# EAGLE design Sandy R2 (EAGLE 7.2.0)
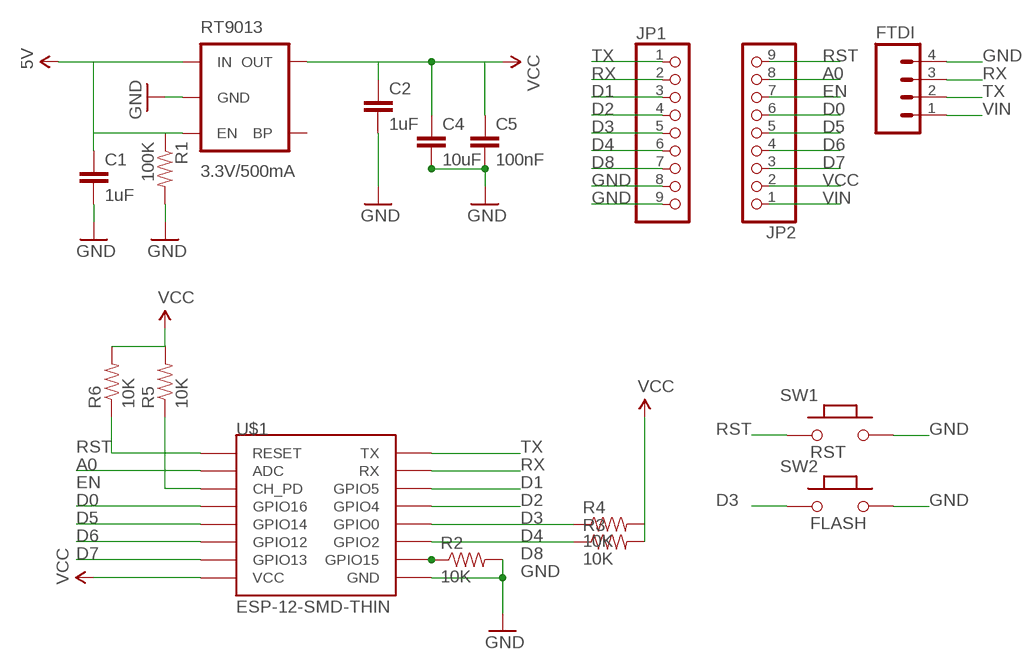
[diagram p0: schematic, sheet 1]

## Parts
C1  1uF  CAP0805  [0805]
C2  1uF  22UF-6.3V-20%(0805)  [0805]
C4  10uF  CAP0805  [0805]
C5  100nF  22UF-6.3V-20%(0805)  [0805]
FTDI  M04PTH  [1X04]
JP1  PINHD-1X9  [1X09-BIG]
JP2  PINHD-1X9  [1X09-BIG]
R1  100K  RESISTOR0805-RES  [0805]
R2  10K  RESISTOR0805-RES  [0805]
R3  10K  RESISTOR0805-RES  [0805]
R4  10K  RESISTOR0805-RES  [0805]
R5  10K  RESISTOR0805-RES  [0805]
R6  10K  RESISTOR0805-RES  [0805]
RT9013  3.3V/500mA  V_REG_MIC52053.3V  [SOT23-5]
SW1  RST  PB157  [157SW]
SW2  FLASH  PB157  [157SW]
U$1  ESP-12-SMD-THIN  [ESP-12-SMD-THIN]

## Nets
A0: JP2.8 U$1.ADC
D0: JP2.6 U$1.GPIO16
D1: JP1.3 U$1.GPIO5
D2: JP1.4 U$1.GPIO4
D3: JP1.5 R4.1 SW2.1 U$1.GPIO0
D4: JP1.6 R3.1 U$1.GPIO2
D5: JP2.5 U$1.GPIO14
D6: JP2.4 U$1.GPIO12
D7: JP2.3 U$1.GPIO13
D8: JP1.7 R2.1 U$1.GPIO15
EN: JP2.7 R5.1 U$1.CH_PD
GND: C1.2 C2.2 C4.2 C5.2 FTDI.4 JP1.8 JP1.9 R1.2 R2.2 RT9013.2(GND) SW1.2 SW2.2 U$1.GND
RST: JP2.9 R6.1 SW1.1 U$1.RESET
RX: FTDI.3 JP1.2 U$1.RXD0(RX)
TX: FTDI.2 JP1.1 U$1.TXD0(TX)
VCC: C2.1 C4.1 C5.1 JP2.2 R3.2 R4.2 R5.2 R6.2 RT9013.5(OUT) U$1.VCC
VIN: C1.1 FTDI.1 JP2.1 R1.1 RT9013.1(IN) RT9013.3(EN) ; supply symbol labelled 5V
Unconnected: RT9013.4(BP)

## Library data of the parts
C1 C4 = SparkFun-Passives:CAP: Capacitor Standard 0603 ceramic capacitor, and 0.1" leaded capacitor.
C2 C5 = SparkFun-Capacitors:22UF-6.3V-20%(0805): CAP-08402 Ceramic; PROD_ID: CAP-08402; VALUE: 22uF
FTDI = SparkFun-Connectors:M04: Header 4 Standard 4-pin 0.1" header. Use with straight break away headers (SKU : PRT-00116), right angle break away headers (PRT-00553), swiss pins (PRT-00743), machine pins (PRT-00117), and female headers (PRT-00115). Molex polarized connector foot print use with SKU : PRT-08231 with associated crimp pins and housings. 1MM SMD Version SKU: PRT-10208
JP1 JP2 = adafruit:PINHD-1X9: Pin header 1x10 0.1" spacing With round pins
R1-R6 = SparkFun-Passives:RESISTOR: Resistor Basic schematic elements and footprints for 0603, 1206, and PTH resistors.
RT9013 = SparkFun-PowerIC:V_REG_MIC5205: V_REG MIC5205 Standard 3.3V, 5V, and Adjustable 150mA LDO voltage regulator in SOT-23 layout. Micrel part MIC5205. BP (by-pass) pin is used to lower output noise with 470pF cap, may be left open. On the adjustable version BP is used to set output.; PROD_ID: VREG-00822; VALUE: 3.3V/150mA
SW1 SW2 = MySMD:PB157
U$1 = My Eagle Lib:ESP-12-SMD-THIN

## Board
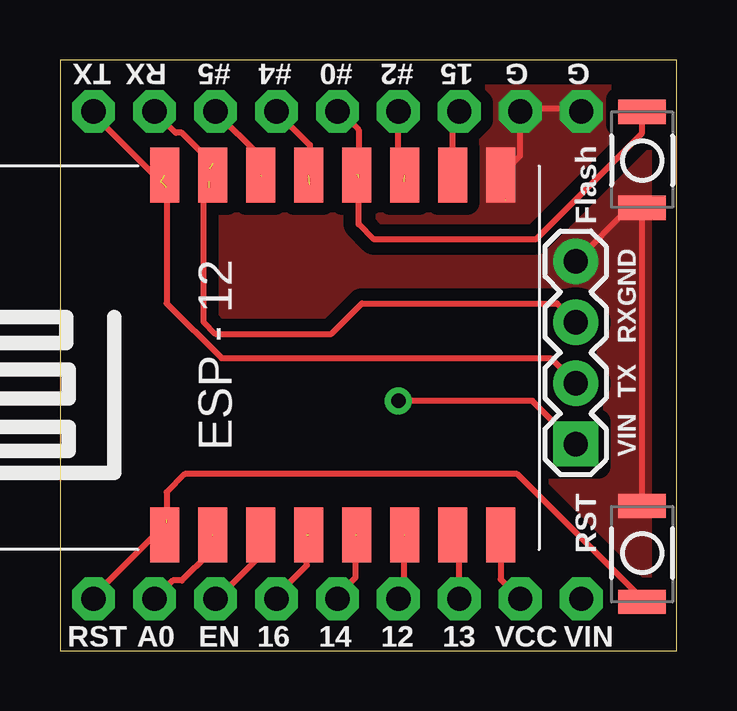
[diagram p1: board, top side]
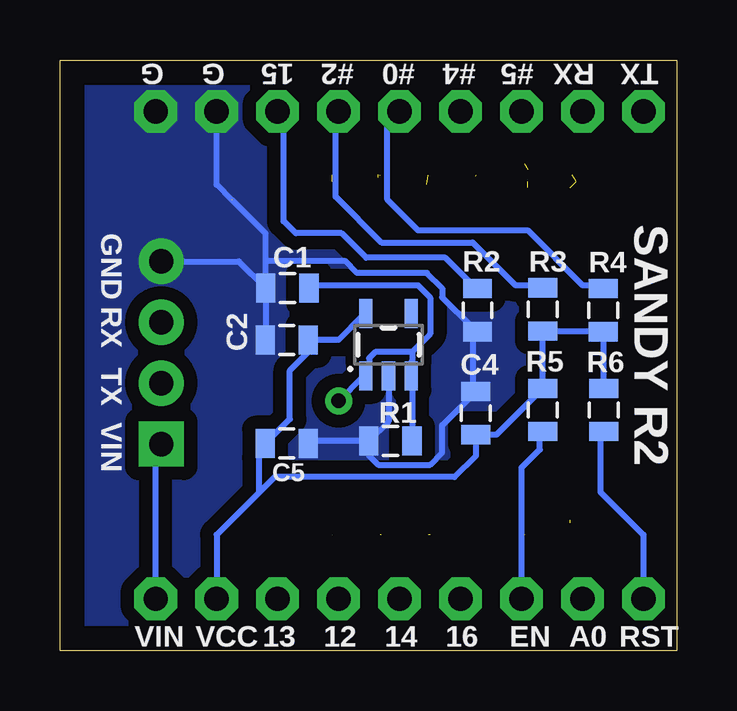
[diagram p2: board, bottom side, seen from below]

Size 25.71 x 24.63 mm. Coordinates in mm from the lower left corner, seen from the top.
Outline: 0,24.63 0,0 25.71,0 25.71,24.63 0,24.63
Copper layers (1*16): Top 0.035mm / dielectric 1.5mm / Bottom 0.035mm
Design rules "default *": minimum track width 10mil, minimum drill 24mil, track to track 10mil, track to pad 10mil, pad to pad 10mil, via to via 10mil, smd to smd 10mil, copper to edge 40mil, drill to drill 10mil, minimum pad ring 13mil, minimum via ring 10mil, stop-mask expansion 4mil, vias tented up to drill 0mil, thermal gap 10mil

### Footprints (pad centres in the part's own frame; a part is rotated, then mirrored left to right if it is on the bottom)
0805 = smd 0.8 x 1.2: 1 -0.9,0; 2 0.9,0
1X04 = drill 1.016 pad 1.88 square: 1 0,0 | drill 1.016 pad 1.88: 2 2.54,0; 3 5.08,0; 4 7.62,0
1X09-BIG = drill 1.016 pad 1.778 octagon: 1 -10.16,0; 2 -7.62,0; 3 -5.08,0; 4 -2.54,0; 5 0,0; 6 2.54,0; 7 5.08,0; 8 7.62,0; 9 10.16,0
SOT23-5 = smd 0.55 x 1.2: 1 -0.95,-1.3; 2 0,-1.3; 3 0.95,-1.3; 4 0.95,1.3; 5 -0.95,1.3
157SW = smd 1.016 x 1.981: 1 0,0; 2 4,0
ESP-12-SMD-THIN = smd 2.286 x 1.2: ADC -7.5,3.8; CH_PD -7.5,1.8; GND 7.5,-8.2; GPIO0 7.5,-2.2; GPIO2 7.5,-4.2; GPIO4 7.5,-0.2; GPIO5 7.5,1.8; GPIO12 -7.5,-4.2; GPIO13 -7.5,-6.2; GPIO14 -7.5,-2.2; GPIO15 7.5,-6.2; GPIO16 -7.5,-0.2; RESET -7.5,5.8; RXD0 7.5,3.8; TXD0 7.5,5.8; VCC -7.5,-8.2

### Placement (x,y rotation side)
C1  16.23,15.11 180 bottom
C2  16.26,12.95 180 bottom
C4  8.38,9.91 90 bottom
C5  16.26,8.64 0 bottom
FTDI  21.49,8.61 90 top
JP1  11.56,22.48 0 top
JP2  11.56,2.16 180 top
R1  11.94,8.74 180 bottom
R2  8.31,14.2 270 bottom
R3  5.59,14.22 270 bottom
R4  3.07,14.2 270 bottom
R5  5.59,10.03 90 bottom
R6  3.05,10.03 90 bottom
RT9013  12.01,12.75 0 bottom
SW1  24.26,2.03 90 top
SW2  24.26,22.47 270 top
U$1  10.16,12.32 90 top

### Tracks (layer width: path | path; a pad name or v marks a point on that pad's centre or on a via)
A0  (1 unrouted)
  Top 0.254: U$1.ADC 6.22,4.06 5.08,2.92 4.7,2.92 JP2.8 3.94,2.29
D0  (1 unrouted)
  Top 0.254: 10.29,4.83 10.29,3.56 9.02,2.29 JP2.6
D1  (1 unrouted)
  Top 0.254: JP1.3 8.38,20.57 8.38,19.78
D2  (1 unrouted)
  Top 0.254: JP1.4 10.41,21.08 10.41,19.43
D3  (2 unrouted)
  Top 0.254: JP1.5 11.68,22.48 12.45,21.72 12.45,19.84 | 12.45,19.72 12.45,17.78 13.08,17.15 19.82,17.15 24.26,21.58 SW2.1
  Bottom 0.254: R4.1 3.17,15.24 3.94,15.24 6.22,17.53 10.79,17.53 12.06,18.8 12.06,21.97 JP1.5
D4  (1 unrouted)
  Top 0.254: JP1.6 14.1,19.81 14.35,19.56
  Bottom 0.254: R3.1 5.72,15.24 6.73,15.24 8.51,17.02 12.32,17.02 14.22,18.92 14.22,22.35 JP1.6
D5  (1 unrouted)
  Top 0.254: 12.32,4.83 12.32,3.05 11.56,2.29 JP2.5
D6  (1 unrouted)
  Top 0.254: U$1.GPIO12 14.35,2.54 14.1,2.29 JP2.4
D7
  Top 0.254: JP2.3 16.64,4.54 U$1.GPIO13
D8
  Top 0.254: U$1.GPIO15 16.36,22.2 JP1.7
  Bottom 0.254: R2.1 8.37,15.1 9.65,16.38 12.95,16.38 13.97,17.4 15.88,17.4 16.38,17.91 16.38,22.23 JP1.7
EN
  Top 0.254: JP2.7 6.55,2.16 8.36,3.96 U$1.CH_PD
  Bottom 0.254: R5.1 5.72,8.89 5.72,8.38 6.48,7.62 JP2.7
GND  (1 unrouted)
  Top 0.254: JP1.9 21.72,22.61 19.18,22.61 JP1.8 19.18,20.64 U$1.GND | SW1.2 SW2.2 23.73,18.47 FTDI.4
  Bottom 0.254: 17.14,16.26 17.14,17.4 18.55,18.8 | 17.14,16.26 17.14,15.24 C1.2 | 17.14,16.26 13.84,16.26 13.34,15.75 10.41,15.75 9.78,15.11 9.78,14.73 8.51,13.46 R2.2 8.51,13.21 8.51,10.92 C4.2 8.51,10.67 9.78,9.4 9.78,8.26 10.29,7.75 12.45,7.75 12.83,8.13 12.83,8.73 R1.2 | R1.2 15.25,8.74 C5.2 | RT9013.2 12.01,9.56 R1.2 | C1.2 17.13,12.98 C2.2 | 18.55,18.79 19.18,19.42 JP1.8 | FTDI.4 18.25,16.23 C1.2
  pour Bottom (isolate 0.559, no thermals): -1.52,26.04 27.18,26.04 27.18,-1.02 -1.52,-1.02
  pour Top (isolate 0.508, no thermals): -1.52,26.04 27.18,26.04 27.18,-1.02 -1.52,-1.02
RST  (1 unrouted)
  Top 0.254: 4.44,5.33 4.13,5.02 | 4.13,5.02 1.4,2.29 JP2.9 | 4.44,5.46 4.44,6.6 5.21,7.37 19.05,7.37 24.26,2.16 SW1.1 | U$1.RESET 4.16,5.02 4.13,5.02
  Bottom 0.254: R6.1 3.17,8.89 3.17,6.6 1.4,4.83 JP2.9
RX  (2 unrouted)
  Top 0.254: 6.22,20.07 6.22,19.56 | 3.94,22.35 JP1.2 4.83,21.59 5.08,21.59 6.36,20.31 U$1.RXD0 | 6.22,19.3 5.97,19.05 5.97,13.72 6.48,13.21 11.3,13.21 12.57,14.48 20.7,14.48 FTDI.3
TX  (2 unrouted)
  Top 0.254: 4.19,19.56 1.4,22.35 JP1.1 | 4.44,19.3 4.44,14.48 6.73,12.19 20.45,12.19 FTDI.2
VCC
  Top 0.254: U$1.VCC 18.36,2.98 JP2.2
  Bottom 0.254: RT9013.5 13.08,13.97 14.1,12.95 C2.1 15.37,12.45 16.13,11.68 16.13,9.65 C5.1 17.4,8.64 17.4,6.6 | 17.4,6.6 19.18,4.83 JP2.2 | 17.4,6.6 16.76,7.24 9.27,7.24 8.38,8.13 C4.1 7.51,9.01 R5.2 R3.2 3.1,13.32 R4.2 3.07,10.96 R6.2
VIN  (via drill 0.61)
  Top 0.254: v14.1,10.41 19.68,10.41 FTDI.1
  Bottom 0.254: 11.05,12.45 12.57,12.45 12.83,12.19 12.83,11.68 RT9013.1 13.08,11.43 v14.1,10.41 | 11.05,12.45 10.29,13.21 10.29,14.73 10.79,15.24 15.11,15.24 C1.1 | 11.05,12.45 11.04,12.45 11.04,12.06 | 11.04,12.06 R1.1 | RT9013.3 11.06,12.04 11.04,12.06 | JP2.1 21.72,8.38 FTDI.1

### Text on the board
tNames: TX | RX | #5 | #4 | #0 | #2 | 15 | G | G | Flash | GND | RX | TX | VIN | RST | RST | A0 | EN | 16 | 14 | 12 | 13 | VCC | VIN
bNames: TX | RX | #5 | #4 | #0 | #2 | 15 | G | G | SANDY R2 | GND | RX | TX | VIN | RST | A0 | EN | 16 | 14 | 12 | 13 | VCC | VIN